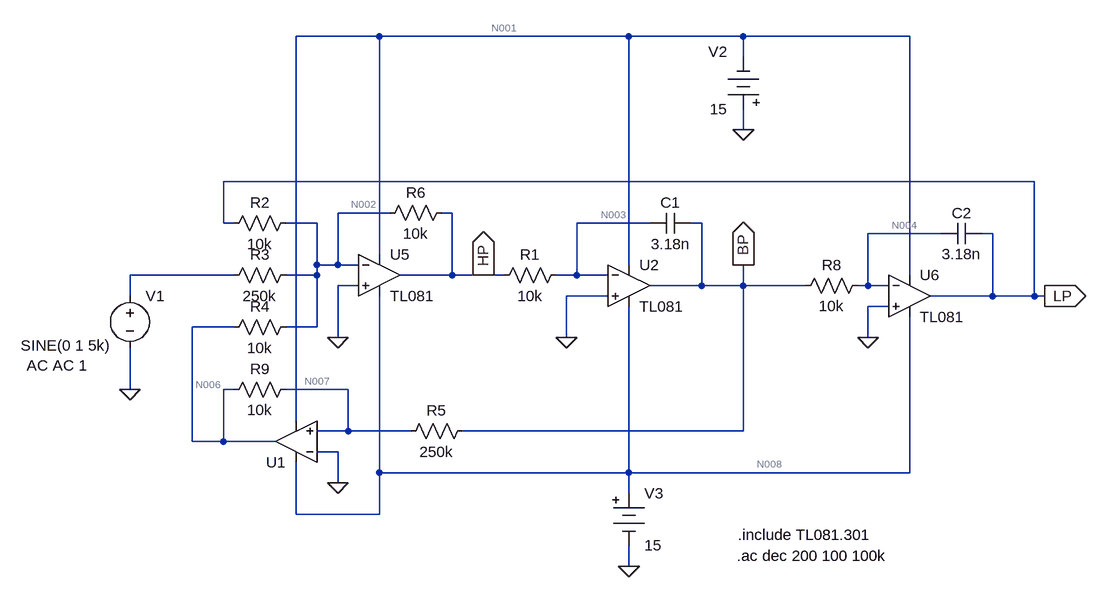
[diagram p0: schematic State-variable filter.asc]
State-variable filter.asc, the LTspice schematic file:
Version 4
SHEET 1 1160 680
WIRE 48 -256 -80 -256
WIRE 432 -256 48 -256
WIRE 608 -256 432 -256
WIRE 864 -256 608 -256
WIRE 608 -224 608 -256
WIRE 608 -112 608 -144
WIRE 1056 -32 -192 -32
WIRE 64 16 -16 16
WIRE 160 16 144 16
WIRE -192 32 -192 -32
WIRE -176 32 -192 32
WIRE -48 32 -96 32
WIRE 464 32 352 32
WIRE 544 32 528 32
WIRE 912 48 800 48
WIRE 992 48 976 48
WIRE 48 80 48 -256
WIRE -48 96 -48 32
WIRE -16 96 -16 16
WIRE -16 96 -48 96
WIRE 16 96 -16 96
WIRE 432 96 432 -256
WIRE -176 112 -336 112
WIRE -48 112 -48 96
WIRE -48 112 -96 112
WIRE 160 112 160 16
WIRE 160 112 80 112
WIRE 208 112 160 112
WIRE 240 112 208 112
WIRE 352 112 352 32
WIRE 352 112 320 112
WIRE 400 112 352 112
WIRE 864 112 864 -256
WIRE 16 128 -16 128
WIRE 544 128 544 32
WIRE 544 128 464 128
WIRE 608 128 608 96
WIRE 608 128 544 128
WIRE 704 128 608 128
WIRE 800 128 800 48
WIRE 800 128 784 128
WIRE 832 128 800 128
WIRE -336 144 -336 112
WIRE 400 144 336 144
WIRE 992 144 992 48
WIRE 992 144 896 144
WIRE 1056 144 1056 -32
WIRE 1056 144 992 144
WIRE 1072 144 1056 144
WIRE 832 160 800 160
WIRE -176 192 -240 192
WIRE -48 192 -48 112
WIRE -48 192 -96 192
WIRE -16 208 -16 128
WIRE 336 208 336 144
WIRE 800 208 800 160
WIRE -336 288 -336 224
WIRE -176 288 -192 288
WIRE 0 288 -96 288
WIRE -80 336 -80 -256
WIRE 0 352 0 288
WIRE 0 352 -48 352
WIRE 96 352 0 352
WIRE 608 352 608 128
WIRE 608 352 176 352
WIRE -240 368 -240 192
WIRE -192 368 -192 288
WIRE -192 368 -240 368
WIRE -112 368 -192 368
WIRE -16 384 -48 384
WIRE 48 416 48 144
WIRE 432 416 432 160
WIRE 432 416 48 416
WIRE 864 416 864 176
WIRE 864 416 432 416
WIRE -16 432 -16 384
WIRE 432 448 432 416
WIRE -80 480 -80 400
WIRE 48 480 48 416
WIRE 48 480 -80 480
WIRE 432 560 432 528
FLAG -336 288 0
FLAG -16 208 0
FLAG -16 432 0
FLAG 336 208 0
FLAG 800 208 0
FLAG 608 -112 0
FLAG 432 560 0
FLAG 1072 144 LP
IOPIN 1072 144 Out
FLAG 608 96 BP
IOPIN 608 96 Out
FLAG 208 112 HP
IOPIN 208 112 Out
SYMBOL res -80 16 R90
WINDOW 0 0 56 VBottom 2
WINDOW 3 32 56 VTop 2
SYMATTR InstName R2
SYMATTR Value 10k
SYMBOL res -80 96 R90
WINDOW 0 0 56 VBottom 2
WINDOW 3 32 56 VTop 2
SYMATTR InstName R3
SYMATTR Value 250k
SYMBOL res -80 176 R90
WINDOW 0 0 56 VBottom 2
WINDOW 3 32 56 VTop 2
SYMATTR InstName R4
SYMATTR Value 10k
SYMBOL res 192 336 R90
WINDOW 0 0 56 VBottom 2
WINDOW 3 32 56 VTop 2
SYMATTR InstName R5
SYMATTR Value 250k
SYMBOL res 160 0 R90
WINDOW 0 0 56 VBottom 2
WINDOW 3 32 56 VTop 2
SYMATTR InstName R6
SYMATTR Value 10k
SYMBOL res 800 112 R90
WINDOW 0 0 56 VBottom 2
WINDOW 3 32 56 VTop 2
SYMATTR InstName R8
SYMATTR Value 10k
SYMBOL res -80 272 R90
WINDOW 0 0 56 VBottom 2
WINDOW 3 32 56 VTop 2
SYMATTR InstName R9
SYMATTR Value 10k
SYMBOL res 336 96 R90
WINDOW 0 0 56 VBottom 2
WINDOW 3 32 56 VTop 2
SYMATTR InstName R1
SYMATTR Value 10k
SYMBOL cap 528 16 R90
WINDOW 0 0 32 VBottom 2
WINDOW 3 32 32 VTop 2
SYMATTR InstName C1
SYMATTR Value 3.18n
SYMBOL cap 976 32 R90
WINDOW 0 0 32 VBottom 2
WINDOW 3 32 32 VTop 2
SYMATTR InstName C2
SYMATTR Value 3.18n
SYMBOL Misc\\battery 608 -128 R180
WINDOW 0 24 104 Left 2
WINDOW 3 24 16 Left 2
WINDOW 123 0 0 Left 0
WINDOW 39 0 0 Left 0
SYMATTR InstName V2
SYMATTR Value 15
SYMBOL Misc\\battery 432 432 R0
WINDOW 123 0 0 Left 0
WINDOW 39 0 0 Left 0
SYMATTR InstName V3
SYMATTR Value 15
SYMBOL OpAmps\\opamp2 432 64 R0
SYMATTR InstName U2
SYMATTR Value TL081
SYMBOL OpAmps\\opamp2 48 48 R0
SYMATTR InstName U5
SYMATTR Value TL081
SYMBOL OpAmps\\opamp2 864 80 R0
SYMATTR InstName U6
SYMATTR Value TL081
SYMBOL OpAmps\\UniversalOpAmp2 -80 368 R180
SYMATTR InstName U1
SYMBOL voltage -336 128 R0
WINDOW 3 -168 92 Left 2
WINDOW 123 -159 123 Left 2
WINDOW 39 0 0 Left 0
SYMATTR InstName V1
SYMATTR Value SINE(0 1 5k)
SYMATTR Value2 AC AC 1
TEXT 600 512 Left 2 !.include TL081.301
TEXT 598 544 Left 2 !.ac dec 200 100 100k

The netlist it stands for:
* State-variable filter.asc
R2 N002 LP 10k
R3 N002 N005 250k
R4 N002 N006 10k
R5 BP N007 250k
R6 HP N002 10k
R8 N004 BP 10k
R9 N007 N006 10k
R1 N003 HP 10k
C1 BP N003 3.18n
C2 LP N004 3.18n
V2 0 N001 15
V3 N008 0 15
XU2 0 N003 N001 N008 BP TL081  ; pins In+ In- V+ V- OUT
XU5 0 N002 N001 N008 HP TL081  ; pins In+ In- V+ V- OUT
XU6 0 N004 N001 N008 LP TL081  ; pins In+ In- V+ V- OUT
XU1 N007 0 N008 N001 N006 level2 Avol=1Meg GBW=10Meg Slew=10Meg Ilimit=25m Rail=0 Vos=0 En=0 Enk=0 In=0 Ink=0 Rin=500Meg  ; pins In+ In- V+ V- OUT
V1 N005 0 SINE(0 1 5k) AC AC 1
.include TL081.301
.ac dec 200 100 100k
.lib UniversalOpAmp2.lib
.backanno
.end

* Results of the author's LTspice run, read from the files saved beside the schematic
* Operating Point, zero values left out:
*   V(n002) = 3.418 V
*   V(n006) = -14.98 V
*   V(n007) = -14.4 V
*   V(n004) = 9.227 V
*   V(n003) = 9.227 V
*   V(n001) = -15 V
*   V(n008) = 15 V
*   I(R2) = 341.8 µA
*   I(R3) = 13.67 µA
*   I(R4) = 1.84 mA
*   I(R5) = 57.62 µA
*   I(R6) = -341.8 µA
*   I(R8) = 922.7 µA
*   I(R9) = 57.64 µA
*   I(R1) = 922.7 µA
*   I(V2) = -132.6 TA
*   I(V3) = -132.6 TA
*   I(V1) = 13.67 µA
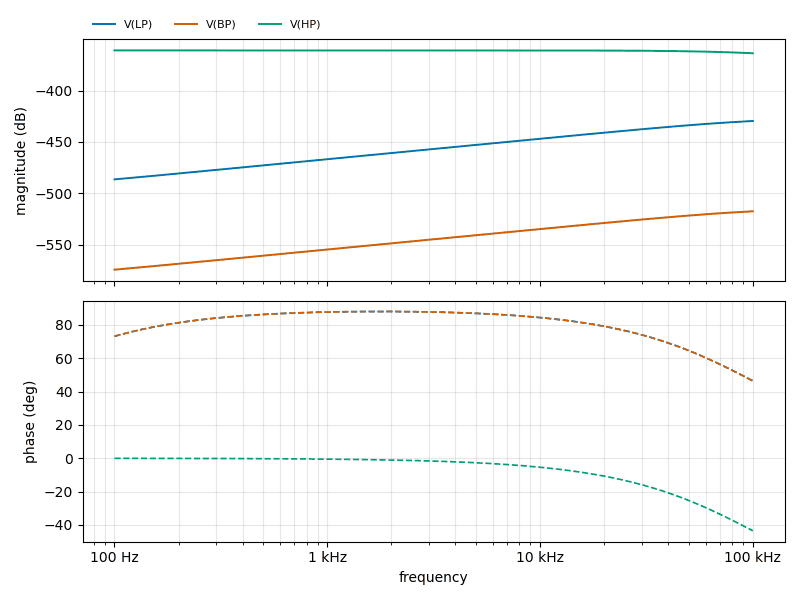
[diagram p1: AC Analysis of State-variable filter.asc, plotted from the saved traces]
* AC Analysis, 1 run:
*   V(LP): -486.42 dB at 100 Hz, -429.57 dB at 100 kHz, peak -429.57 dB at 100 kHz, 3 dB below the peak at 58.82 kHz
*   V(BP): -574.38 dB at 100 Hz, -517.52 dB at 100 kHz, peak -517.52 dB at 100 kHz, 3 dB below the peak at 58.82 kHz
*   V(HP): -360.81 dB at 100 Hz, -363.57 dB at 100 kHz, peak -360.81 dB at 100 Hz